# Altium schematic sheet Sheet2.SchDoc
size A4
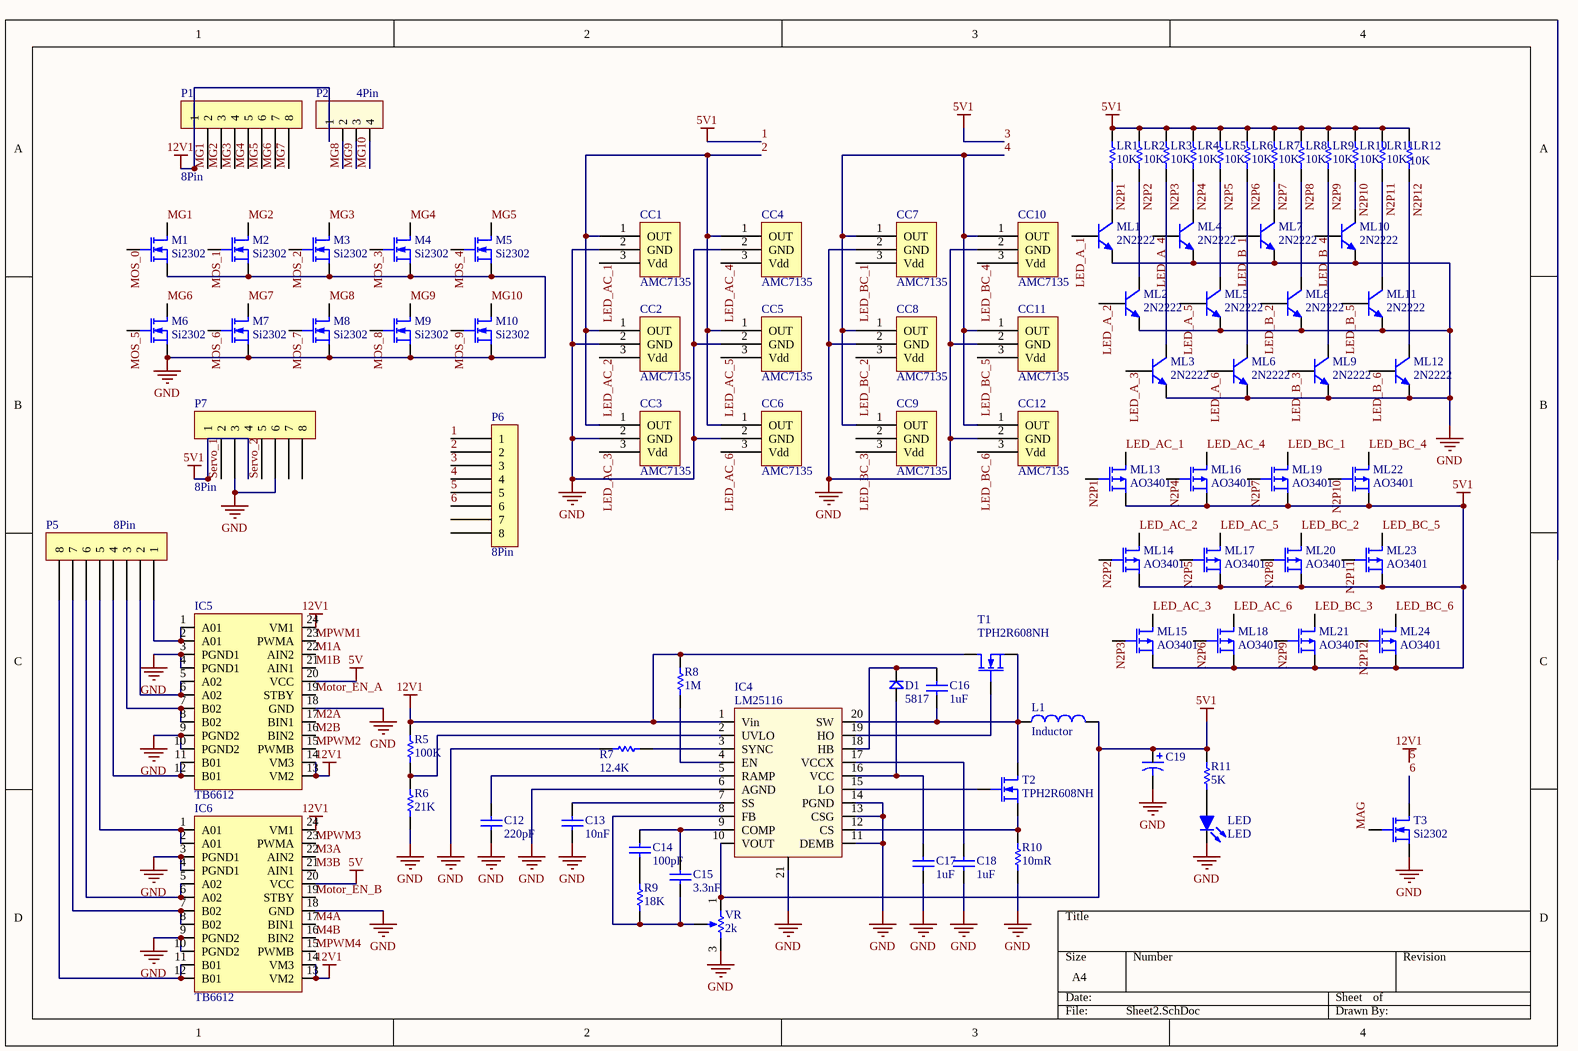
[diagram p0: Sheet2.SchDoc]

## Parts
C12  220pF  [C0805]
C13  10nF  [C0805]
C14  100pF  [C0805]
C15  3.3nF  [C0805]
C16  1uF  [C0805]
C17  1uF  [C0805]
C18  1uF  [C0805]
C19  *  [Cap SMD 10x12.7mm]  (value not drawn)
CC1  AMC7135  [SOT89-150P410X160-3L]
CC2  AMC7135  [SOT89-150P410X160-3L]
CC3  AMC7135  [SOT89-150P410X160-3L]
CC4  AMC7135  [SOT89-150P410X160-3L]
CC5  AMC7135  [SOT89-150P410X160-3L]
CC6  AMC7135  [SOT89-150P410X160-3L]
CC7  AMC7135  [SOT89-150P410X160-3L]
CC8  AMC7135  [SOT89-150P410X160-3L]
CC9  AMC7135  [SOT89-150P410X160-3L]
CC10  AMC7135  [SOT89-150P410X160-3L]
CC11  AMC7135  [SOT89-150P410X160-3L]
CC12  AMC7135  [SOT89-150P410X160-3L]
D1  5817  [Diode-SOD-323]
IC4  LM25116  [HTSSOP-20]
IC5  TB6612  [SSOP24]
IC6  TB6612  [SSOP24]
L1  Inductor  [Inductor-CDEP147]
LED  LED  [LED-0805]
LR1  10K  [R0805]
LR2  10K  [R0805]
LR3  10K  [R0805]
LR4  10K  [R0805]
LR5  10K  [R0805]
LR6  10K  [R0805]
LR7  10K  [R0805]
LR8  10K  [R0805]
LR9  10K  [R0805]
LR10  10K  [R0805]
LR11  10K  [R0805]
LR12  10K  [R0805]
M1  Si2302  [SOT23]
M2  Si2302  [SOT23]
M3  Si2302  [SOT23]
M4  Si2302  [SOT23]
M5  Si2302  [SOT23]
M6  Si2302  [SOT23]
M7  Si2302  [SOT23]
M8  Si2302  [SOT23]
M9  Si2302  [SOT23]
M10  Si2302  [SOT23]
ML1  2N2222  [SOT23]
ML2  2N2222  [SOT23]
ML3  2N2222  [SOT23]
ML4  2N2222  [SOT23]
ML5  2N2222  [SOT23]
ML6  2N2222  [SOT23]
ML7  2N2222  [SOT23]
ML8  2N2222  [SOT23]
ML9  2N2222  [SOT23]
ML10  2N2222  [SOT23]
ML11  2N2222  [SOT23]
ML12  2N2222  [SOT23]
ML13  AO3401  [SOT23]
ML14  AO3401  [SOT23]
ML15  AO3401  [SOT23]
ML16  AO3401  [SOT23]
ML17  AO3401  [SOT23]
ML18  AO3401  [SOT23]
ML19  AO3401  [SOT23]
ML20  AO3401  [SOT23]
ML21  AO3401  [SOT23]
ML22  AO3401  [SOT23]
ML23  AO3401  [SOT23]
ML24  AO3401  [SOT23]
P1  8Pin  [XH2.54-8pin_SMD]
P2  4Pin  [XH2.54-4pin_SMD]
P5  8Pin  [XH2.54-8pin_SMD]
P6  8Pin  [XH2.54-8pin_SMD]
P7  8Pin  [XH2.54-8pin_SMD]
R5  100K  [R0805]
R6  21K  [R0805]
R7  12.4K  [R0805]
R8  1M  [R0805]
R9  18K  [R0805]
R10  10mR  [R2010]
R11  5K  [R0805]
T1  TPH2R608NH  [TPH2R608NH]
T2  TPH2R608NH  [TPH2R608NH]
T3  Si2302  [SOT23]
VR  2k  [3224W-1-202E]

## Nets
1: C19.1 IC4.10(VOUT) L1.2 LR1.2 LR2.2 LR3.2 LR4.2 LR5.2 LR6.2 LR7.2 LR8.2 LR9.2 LR10.2 LR11.2 LR12.2 ML13.2(S) ML14.2(S) ML15.2(S) ML16.2(S) ML17.2(S) ML18.2(S) ML19.2(S) ML20.2(S) ML21.2(S) ML22.2(S) ML23.2(S) ML24.2(S) P6.1 P6.3 P7.1 P7.4 R11.2 VR.1(TOP)  [also labelled 3, 5V1]
5: IC4.1(Vin) IC5.13(VM2) IC5.14(VM3) IC5.24(VM1) IC6.13(VM2) IC6.14(VM3) IC6.24(VM1) P1.1 P2.1 P6.5 R5.2 R8.2 T1.1(D)  [also labelled 12V1]
5V: IC5.20(VCC) IC6.20(VCC)
GND: C12.1 C13.1 C17.1 C18.1 C19.2 CC1.2(GND) CC2.2(GND) CC3.2(GND) CC4.2(GND) CC5.2(GND) CC6.2(GND) CC7.2(GND) CC8.2(GND) CC10.2(GND) CC11.2(GND) CC12.2(GND) IC4.6(AGND) IC4.11(DEMB) IC4.13(CSG) IC4.14(PGND) IC4.21 IC5.3(PGND1) IC5.4(PGND1) IC5.9(PGND2) IC5.10(PGND2) IC5.18(GND) IC6.3(PGND1) IC6.4(PGND1) IC6.9(PGND2) IC6.10(PGND2) IC6.18(GND) LED.2(K) M1.2(S) M2.2(S) M3.2(S) M4.2(S) M5.2(S) M6.2(S) M7.2(S) M8.2(S) M9.2(S) M10.2(S) ML1.2(E) ML2.2(E) ML3.2(E) ML4.2(E) ML5.2(E) ML6.2(E) ML7.2(E) ML8.2(E) ML9.2(E) ML10.2(E) ML11.2(E) ML12.2(E) P7.3 P7.6 R6.1 R7.1 R10.1 T3.2(S) VR.3(BOT)
2: CC1.1(OUT) CC2.1(OUT) CC3.1(OUT) CC4.1(OUT) CC5.1(OUT) CC6.1(OUT) P6.2
4: CC7.1(OUT) CC8.1(OUT) CC9.1(OUT) CC10.1(OUT) CC11.1(OUT) CC12.1(OUT) P6.4
6: P6.6 T3.3(D)
LED_A_1: ML1.1(B)
LED_A_2: ML2.1(B)
LED_A_3: ML3.1(B)
LED_A_4: ML4.1(B)
LED_A_5: ML5.1(B)
LED_A_6: ML6.1(B)
LED_AC_1: CC1.3(Vdd) ML13.3(D)
LED_AC_2: CC2.3(Vdd) ML14.3(D)
LED_AC_3: CC3.3(Vdd) ML15.3(D)
LED_AC_4: CC4.3(Vdd) ML16.3(D)
LED_AC_5: CC5.3(Vdd) ML17.3(D)
LED_AC_6: CC6.3(Vdd) ML18.3(D)
LED_B_1: ML7.1(B)
LED_B_2: ML8.1(B)
LED_B_3: ML9.1(B)
LED_B_4: ML10.1(B)
LED_B_5: ML11.1(B)
LED_B_6: ML12.1(B)
LED_BC_1: CC7.3(Vdd) ML19.3(D)
LED_BC_2: CC8.3(Vdd) ML20.3(D)
LED_BC_3: CC9.3(Vdd) ML21.3(D)
LED_BC_4: CC10.3(Vdd) ML22.3(D)
LED_BC_5: CC11.3(Vdd) ML23.3(D)
LED_BC_6: CC12.3(Vdd) ML24.3(D)
M1A: IC5.22(AIN2)
M1B: IC5.21(AIN1)
M2A: IC5.17(BIN1)
M2B: IC5.16(BIN2)
M3A: IC6.22(AIN2)
M3B: IC6.21(AIN1)
M4A: IC6.17(BIN1)
M4B: IC6.16(BIN2)
MAG: T3.1(G)
MG1: M1.3(D) P1.2
MG2: M2.3(D) P1.3
MG3: M3.3(D) P1.4
MG4: M4.3(D) P1.5
MG5: M5.3(D) P1.6
MG6: M6.3(D) P1.7
MG7: M7.3(D) P1.8
MG8: M8.3(D) P2.2
MG9: M9.3(D) P2.3
MG10: M10.3(D) P2.4
MOS_0: M1.1(G)
MOS_1: M2.1(G)
MOS_2: M3.1(G)
MOS_3: M4.1(G)
MOS_4: M5.1(G)
MOS_5: M6.1(G)
MOS_6: M7.1(G)
MOS_7: M8.1(G)
MOS_8: M9.1(G)
MOS_9: M10.1(G)
Motor_EN_A: IC5.19(STBY)
Motor_EN_B: IC6.19(STBY)
MPWM1: IC5.23(PWMA)
MPWM2: IC5.15(PWMB)
MPWM3: IC6.23(PWMA)
MPWM4: IC6.15(PWMB)
N2P1: LR1.1 ML1.3(C) ML13.1(G)
N2P2: LR2.1 ML2.3(C) ML14.1(G)
N2P3: LR3.1 ML3.3(C) ML15.1(G)
N2P4: LR4.1 ML4.3(C) ML16.1(G)
N2P5: LR5.1 ML5.3(C) ML17.1(G)
N2P6: LR6.1 ML6.3(C) ML18.1(G)
N2P7: LR7.1 ML7.3(C) ML19.1(G)
N2P8: LR8.1 ML8.3(C) ML20.1(G)
N2P9: LR9.1 ML9.3(C) ML21.1(G)
N2P10: LR10.1 ML10.3(C) ML22.1(G)
N2P11: LR11.1 ML11.3(C) ML23.1(G)
N2P12: LR12.1 ML12.3(C) ML24.1(G)
Servo_1: P7.2
Servo_2: P7.5
NetC12_2: C12.2 IC4.5(RAMP)
NetC13_2: C13.2 IC4.7(SS)
NetC14_1: C14.1 R9.2
NetC14_2: C14.2 C15.2 IC4.9(COMP)
NetC15_1: C15.1 IC4.8(FB) R9.1 VR.2(TAP)
NetC16_1: C16.1 IC4.20(SW) L1.1 T1.3(S) T2.1(D)
NetC16_2: C16.2 D1.2(KATHODE) IC4.18(HB)
NetC17_2: C17.2 D1.1(ANODE) IC4.16(VCC)
NetC18_2: C18.2 IC4.17(VCCX)
NetIC4_2: IC4.2(UVLO) R5.1 R6.2
NetIC4_3: IC4.3(SYNC) R7.2
NetIC4_4: IC4.4(EN) R8.1
NetIC4_12: IC4.12(CS) R10.2 T2.3(S)
NetIC4_15: IC4.15(LO) T2.2(G)
NetIC4_19: IC4.19(HO) T1.2(G)
NetIC5_1: IC5.1(A01) IC5.2(A01) P5.1
NetIC5_5: IC5.5(A02) IC5.6(A02) P5.2
NetIC5_7: IC5.7(B02) IC5.8(B02) P5.3
NetIC5_11: IC5.11(B01) IC5.12(B01) P5.4
NetIC6_1: IC6.1(A01) IC6.2(A01) P5.5
NetIC6_5: IC6.5(A02) IC6.6(A02) P5.6
NetIC6_7: IC6.7(B02) IC6.8(B02) P5.7
NetIC6_11: IC6.11(B01) IC6.12(B01) P5.8
NetLED_1: LED.1(A) R11.1

Not connected (* = marked no-connect by the designer): CC9 2(GND); P6 7 8; P7 7 8

## Library data of the parts
C12-C18 = Cap: value: *
C19 = Cap-pol: value: *
D1 = Diode
IC4 = LM25116: Buck Controller
LR1-LR12 R5-R11 = Resistor
  LR1-LR12 R5-R9 R11: value: *
  R10: value: 10mR
ML1-ML12 = 2N2222: NPN
T1 T2 = MOSFET-N
VR = Potentiometer